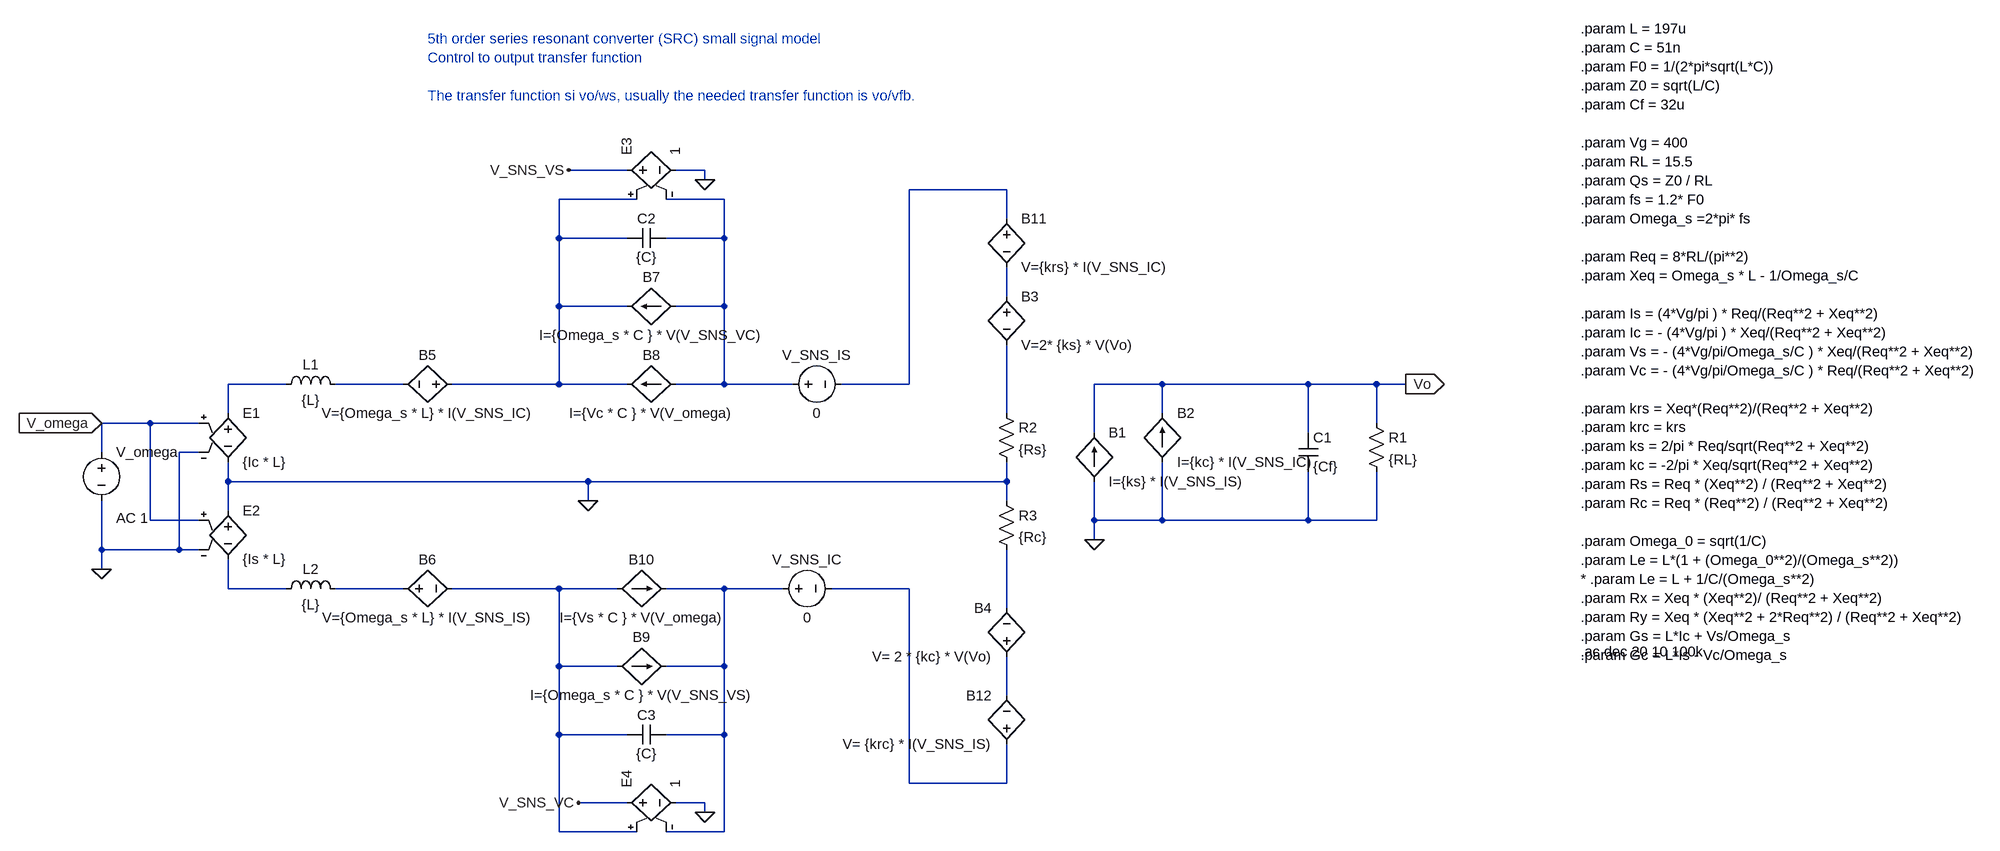
[diagram p0: schematic src_5th_eq_vo-omega.asc]
src_5th_eq_vo-omega.asc, the LTspice schematic file:
Version 4
SHEET 1 2344 1352
WIRE 112 192 16 192
WIRE 240 192 192 192
WIRE 240 208 240 192
WIRE 736 224 576 224
WIRE 128 240 0 240
WIRE 272 240 176 240
WIRE 736 272 736 224
WIRE 0 304 0 240
WIRE 112 304 0 304
WIRE 272 304 272 240
WIRE 272 304 176 304
WIRE 736 400 736 352
WIRE 0 416 0 304
WIRE 112 416 0 416
WIRE 272 416 272 304
WIRE 272 416 192 416
WIRE -448 544 -544 544
WIRE -256 544 -368 544
WIRE 0 544 0 416
WIRE 0 544 -176 544
WIRE 112 544 0 544
WIRE 272 544 272 416
WIRE 272 544 192 544
WIRE 384 544 272 544
WIRE 576 544 576 224
WIRE 576 544 464 544
WIRE 992 544 880 544
WIRE 1232 544 992 544
WIRE 1344 544 1232 544
WIRE 1392 544 1344 544
WIRE -544 592 -544 544
WIRE 736 592 736 480
WIRE 992 592 992 544
WIRE -672 608 -752 608
WIRE -592 608 -672 608
WIRE 1344 608 1344 544
WIRE 880 624 880 544
WIRE 1232 624 1232 544
WIRE -752 656 -752 608
WIRE -592 656 -624 656
WIRE -544 704 -544 672
WIRE 48 704 -544 704
WIRE 736 704 736 672
WIRE 736 704 48 704
WIRE 48 736 48 704
WIRE 736 736 736 704
WIRE -544 752 -544 704
WIRE -672 768 -672 608
WIRE -592 768 -672 768
WIRE 880 768 880 704
WIRE 992 768 992 672
WIRE 992 768 880 768
WIRE 1232 768 1232 688
WIRE 1232 768 992 768
WIRE 1344 768 1344 688
WIRE 1344 768 1232 768
WIRE 880 800 880 768
WIRE -752 816 -752 736
WIRE -624 816 -624 656
WIRE -624 816 -752 816
WIRE -592 816 -624 816
WIRE -752 848 -752 816
WIRE -544 880 -544 832
WIRE -448 880 -544 880
WIRE -256 880 -368 880
WIRE 0 880 -176 880
WIRE 96 880 0 880
WIRE 272 880 176 880
WIRE 368 880 272 880
WIRE 576 880 448 880
WIRE 736 912 736 816
WIRE 0 1008 0 880
WIRE 96 1008 0 1008
WIRE 272 1008 272 880
WIRE 272 1008 176 1008
WIRE 736 1056 736 992
WIRE 0 1120 0 1008
WIRE 112 1120 0 1120
WIRE 272 1120 272 1008
WIRE 272 1120 176 1120
WIRE 576 1200 576 880
WIRE 736 1200 736 1136
WIRE 736 1200 576 1200
WIRE 112 1232 32 1232
WIRE 240 1232 192 1232
WIRE 240 1248 240 1232
WIRE 0 1280 0 1120
WIRE 128 1280 0 1280
WIRE 272 1280 272 1120
WIRE 272 1280 176 1280
FLAG 48 736 0
FLAG -752 848 0
FLAG 880 800 0
FLAG 1392 544 Vo
IOPIN 1392 544 Out
FLAG 240 208 0
FLAG 16 192 V_SNS_VS
FLAG 240 1248 0
FLAG 32 1232 V_SNS_VC
FLAG -752 608 V_omega
IOPIN -752 608 In
SYMBOL res 1328 592 R0
SYMATTR InstName R1
SYMATTR Value {RL}
SYMBOL cap 1216 624 R0
SYMATTR InstName C1
SYMATTR Value {Cf}
SYMBOL bi2 880 624 R0
SYMATTR InstName B1
SYMATTR Value I={ks} * I(V_SNS_IS)
SYMBOL bi2 992 592 R0
SYMATTR InstName B2
SYMATTR Value I={kc} * I(V_SNS_IC)
SYMBOL voltage -752 640 R0
WINDOW 123 24 124 Left 2
WINDOW 39 0 0 Left 2
SYMATTR Value2 AC 1
SYMATTR InstName V_omega
SYMATTR Value ""
SYMBOL e -544 576 R0
SYMATTR InstName E1
SYMATTR Value {Ic * L}
SYMBOL e -544 736 R0
SYMATTR InstName E2
SYMATTR Value {Is * L}
SYMBOL ind -464 560 R270
WINDOW 0 32 56 VTop 2
WINDOW 3 5 56 VBottom 2
SYMATTR InstName L1
SYMATTR Value {L}
SYMBOL bv 736 384 R0
SYMATTR InstName B3
SYMATTR Value V=2* {ks} * V(Vo)
SYMBOL ind -464 896 R270
WINDOW 0 32 56 VTop 2
WINDOW 3 5 56 VBottom 2
SYMATTR InstName L2
SYMATTR Value {L}
SYMBOL bv 736 1008 R180
WINDOW 0 24 96 Left 2
WINDOW 3 24 16 Left 2
SYMATTR InstName B4
SYMATTR Value V= 2 * {kc} * V(Vo)
SYMBOL res 720 576 R0
SYMATTR InstName R2
SYMATTR Value {Rs}
SYMBOL res 720 720 R0
SYMATTR InstName R3
SYMATTR Value {Rc}
SYMBOL voltage 368 544 R270
WINDOW 0 32 56 VTop 2
WINDOW 3 -32 56 VBottom 2
SYMATTR InstName V_SNS_IS
SYMATTR Value 0
SYMBOL bv -160 544 R90
WINDOW 0 -32 56 VBottom 2
WINDOW 3 32 56 VTop 2
SYMATTR InstName B5
SYMATTR Value V={Omega_s * L} * I(V_SNS_IC)
SYMBOL bv -272 880 R270
WINDOW 0 32 56 VTop 2
WINDOW 3 -32 56 VBottom 2
SYMATTR InstName B6
SYMATTR Value V={Omega_s * L} * I(V_SNS_IS)
SYMBOL cap 176 288 R90
WINDOW 0 0 32 VBottom 2
WINDOW 3 32 32 VTop 2
SYMATTR InstName C2
SYMATTR Value {C}
SYMBOL bi2 112 416 R270
WINDOW 0 32 40 VTop 2
WINDOW 3 -32 40 VBottom 2
SYMATTR InstName B7
SYMATTR Value I={Omega_s * C } * V(V_SNS_VC)
SYMBOL bi2 112 544 R270
WINDOW 0 32 40 VTop 2
WINDOW 3 -32 40 VBottom 2
SYMATTR InstName B8
SYMATTR Value I={Vc * C } * V(V_omega)
SYMBOL cap 112 1136 R270
WINDOW 0 32 32 VTop 2
WINDOW 3 0 32 VBottom 2
SYMATTR InstName C3
SYMATTR Value {C}
SYMBOL bi2 176 1008 R90
WINDOW 0 -32 40 VBottom 2
WINDOW 3 32 40 VTop 2
SYMATTR InstName B9
SYMATTR Value I={Omega_s * C } * V(V_SNS_VS)
SYMBOL bi2 176 880 R90
WINDOW 0 -32 40 VBottom 2
WINDOW 3 32 40 VTop 2
SYMATTR InstName B10
SYMATTR Value I={Vs * C } * V(V_omega)
SYMBOL bv 736 256 R0
SYMATTR InstName B11
SYMATTR Value V={krs} * I(V_SNS_IC)
SYMBOL bv 736 1152 R180
WINDOW 0 24 96 Left 2
WINDOW 3 24 16 Left 2
SYMATTR InstName B12
SYMATTR Value V= {krc} * I(V_SNS_IS)
SYMBOL voltage 352 880 R270
WINDOW 0 32 56 VTop 2
WINDOW 3 -32 56 VBottom 2
SYMATTR InstName V_SNS_IC
SYMATTR Value 0
SYMBOL e 96 192 R270
SYMATTR InstName E3
SYMATTR Value 1
SYMBOL e 96 1232 R270
SYMATTR InstName E4
SYMATTR Value 1
TEXT 1680 -40 Left 2 !.param L = 197u\n.param C = 51n\n.param F0 = 1/(2*pi*sqrt(L*C))\n.param Z0 = sqrt(L/C)\n.param Cf = 32u\n \n.param Vg = 400\n.param RL = 15.5\n.param Qs = Z0 / RL\n.param fs = 1.2* F0\n.param Omega_s =2*pi* fs\n \n.param Req = 8*RL/(pi**2)\n.param Xeq = Omega_s * L - 1/Omega_s/C\n \n.param Is = (4*Vg/pi ) * Req/(Req**2 + Xeq**2)\n.param Ic = - (4*Vg/pi ) * Xeq/(Req**2 + Xeq**2)\n.param Vs = - (4*Vg/pi/Omega_s/C ) * Xeq/(Req**2 + Xeq**2)\n.param Vc = - (4*Vg/pi/Omega_s/C ) * Req/(Req**2 + Xeq**2)\n \n.param krs = Xeq*(Req**2)/(Req**2 + Xeq**2)\n.param krc = krs\n.param ks = 2/pi * Req/sqrt(Req**2 + Xeq**2)\n.param kc = -2/pi * Xeq/sqrt(Req**2 + Xeq**2)\n.param Rs = Req * (Xeq**2) / (Req**2 + Xeq**2)\n.param Rc = Req * (Req**2) / (Req**2 + Xeq**2)\n \n.param Omega_0 = sqrt(1/C)\n.param Le = L*(1 + (Omega_0**2)/(Omega_s**2))\n* .param Le = L + 1/C/(Omega_s**2)\n.param Rx = Xeq * (Xeq**2)/ (Req**2 + Xeq**2)\n.param Ry = Xeq * (Xeq**2 + 2*Req**2) / (Req**2 + Xeq**2)\n.param Gs = L*Ic + Vs/Omega_s\n.param Gc = L*Is - Vc/Omega_s
TEXT 1680 984 Left 2 !.ac dec 20 10 100k
TEXT -216 -24 Left 2 ;5th order series resonant converter (SRC) small signal model\nControl to output transfer function\n \nThe transfer function si vo/ws, usually the needed transfer function is vo/vfb.

The netlist it stands for:
* src_5th_eq_vo-omega.asc
R1 Vo 0 {RL}
C1 Vo 0 {Cf}
B1 0 Vo I={ks} * I(V_SNS_IS)
B2 0 Vo I={kc} * I(V_SNS_IC)
V_omega V_omega 0 AC 1
E1 N005 0 V_omega 0 {Ic * L}
E2 0 N008 V_omega 0 {Is * L}
L1 N005 N006 {L}
B3 N004 N007 V=2* {ks} * V(Vo)
L2 N008 N009 {L}
B4 N014 N013 V= 2 * {kc} * V(Vo)
R2 N007 0 {Rs}
R3 0 N013 {Rc}
V_SNS_IS N003 N001 0
B5 N002 N006 V={Omega_s * L} * I(V_SNS_IC)
B6 N009 N010 V={Omega_s * L} * I(V_SNS_IS)
C2 N003 N002 {C}
B7 N003 N002 I={Omega_s * C } * V(V_SNS_VC)
B8 N003 N002 I={Vc * C } * V(V_omega)
C3 N010 N011 {C}
B9 N010 N011 I={Omega_s * C } * V(V_SNS_VS)
B10 N010 N011 I={Vs * C } * V(V_omega)
B11 N001 N004 V={krs} * I(V_SNS_IC)
B12 N012 N014 V= {krc} * I(V_SNS_IS)
V_SNS_IC N011 N012 0
E3 V_SNS_VS 0 N002 N003 1
E4 V_SNS_VC 0 N010 N011 1
.param L = 197u
.param C = 51n
.param F0 = 1/(2*pi*sqrt(L*C))
.param Z0 = sqrt(L/C)
.param Cf = 32u
.param Vg = 400
.param RL = 15.5
.param Qs = Z0 / RL
.param fs = 1.2* F0
.param Omega_s =2*pi* fs
.param Req = 8*RL/(pi**2)
.param Xeq = Omega_s * L - 1/Omega_s/C
.param Is = (4*Vg/pi ) * Req/(Req**2 + Xeq**2)
.param Ic = - (4*Vg/pi ) * Xeq/(Req**2 + Xeq**2)
.param Vs = - (4*Vg/pi/Omega_s/C ) * Xeq/(Req**2 + Xeq**2)
.param Vc = - (4*Vg/pi/Omega_s/C ) * Req/(Req**2 + Xeq**2)
.param krs = Xeq*(Req**2)/(Req**2 + Xeq**2)
.param krc = krs
.param ks = 2/pi * Req/sqrt(Req**2 + Xeq**2)
.param kc = -2/pi * Xeq/sqrt(Req**2 + Xeq**2)
.param Rs = Req * (Xeq**2) / (Req**2 + Xeq**2)
.param Rc = Req * (Req**2) / (Req**2 + Xeq**2)
.param Omega_0 = sqrt(1/C)
.param Le = L*(1 + (Omega_0**2)/(Omega_s**2))
* .param Le = L + 1/C/(Omega_s**2)
.param Rx = Xeq * (Xeq**2)/ (Req**2 + Xeq**2)
.param Ry = Xeq * (Xeq**2 + 2*Req**2) / (Req**2 + Xeq**2)
.param Gs = L*Ic + Vs/Omega_s
.param Gc = L*Is - Vc/Omega_s
.ac dec 20 10 100k
* 5th order series resonant converter (SRC) small signal model
* Control to output transfer function
* The transfer function si vo/ws, usually the needed transfer function is vo/vfb.
.backanno
.end